# Altium project Capstone.PrjPcb
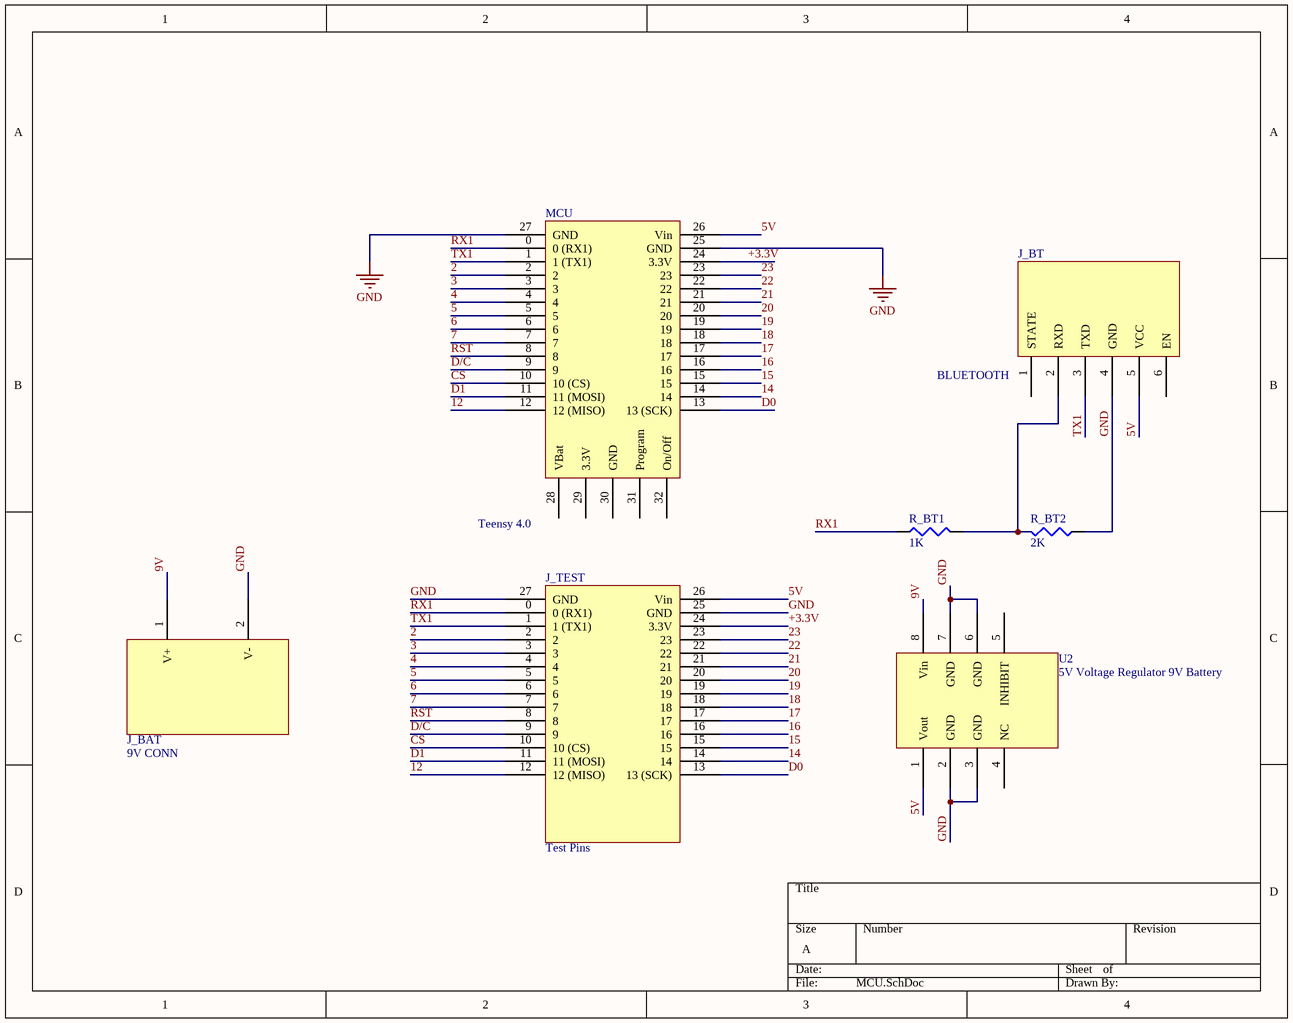
[diagram p0: MCU.SchDoc]
2 sheets, 41 parts. Net scope: global (net labels, ports and power ports of the same name join across sheets).
Board file: PCB.PcbDoc
Sheets:
  MCU.SchDoc
  OLED_BREAKOUT.SchDoc

## Sheet MCU.SchDoc
size A; SheetNumber: 1; SheetTotal: 2

### Parts
J_BAT  9V CONN  [2POS_TERMINAL]
J_BT  BLUETOOTH  [HC05]
J_TEST  Test Pins  [TESTPINS]
MCU  Teensy 4.0  [TEENSY 4.0]
R_BT1  1K  [SMD-0805]
R_BT2  2K  [SMD-0805]
U2  5V Voltage Regulator 9V Battery  [U2_SO-8]

### Nets
+3.3V: J_TEST.24(3.3V) MCU.24(3.3V)
GND: J_BAT.2(V-) J_BT.4(GND) J_TEST.25(GND) J_TEST.27(GND) MCU.25(GND) MCU.27(GND) R_BT2.1 U2.2(GND) U2.3(GND) U2.6(GND) U2.7(GND)
2: J_TEST.2 MCU.2
3: J_TEST.3 MCU.3
4: J_TEST.4 MCU.4
5: J_TEST.5 MCU.5
5V: J_BT.5(VCC) J_TEST.26(Vin) MCU.26(Vin) U2.1(Vout)
6: J_TEST.6 MCU.6
7: J_TEST.7 MCU.7
9V: J_BAT.1(V+) U2.8(Vin)
12: J_TEST.12(12_(MISO)) MCU.12(12_(MISO))
14: J_TEST.14 MCU.14
15: J_TEST.15 MCU.15
16: J_TEST.16 MCU.16
17: J_TEST.17 MCU.17
18: J_TEST.18 MCU.18
19: J_TEST.19 MCU.19
20: J_TEST.20 MCU.20
21: J_TEST.21 MCU.21
22: J_TEST.22 MCU.22
23: J_TEST.23 MCU.23
~{CS}: J_TEST.10(10_(CS)) MCU.10(10_(CS))
D0: J_TEST.13(13_(SCK)) MCU.13(13_(SCK))
D1: J_TEST.11(11_(MOSI)) MCU.11(11_(MOSI))
D/~{C}: J_TEST.9 MCU.9
~{RST}: J_TEST.8 MCU.8
RX1: J_TEST.0(0_(RX1)) MCU.0(0_(RX1)) R_BT1.1
TX1: J_BT.3(TXD) J_TEST.1(1_(TX1)) MCU.1(1_(TX1))
NetJ_BT_2: J_BT.2(RXD) R_BT1.2 R_BT2.2

Not connected (* = marked no-connect by the designer): J_BT 1(STATE) 6(EN); MCU 28(VBat) 29(3.3V) 30(GND) 31(Program) 32(On/Off); U2 4(NC) 5(INHIBIT)

### Library data of the parts
J_BAT = Battery Connector
J_BT = HC05
R_BT1 R_BT2 = Resistor

## Sheet OLED_BREAKOUT.SchDoc
size A; SheetNumber: 2; SheetTotal: 2
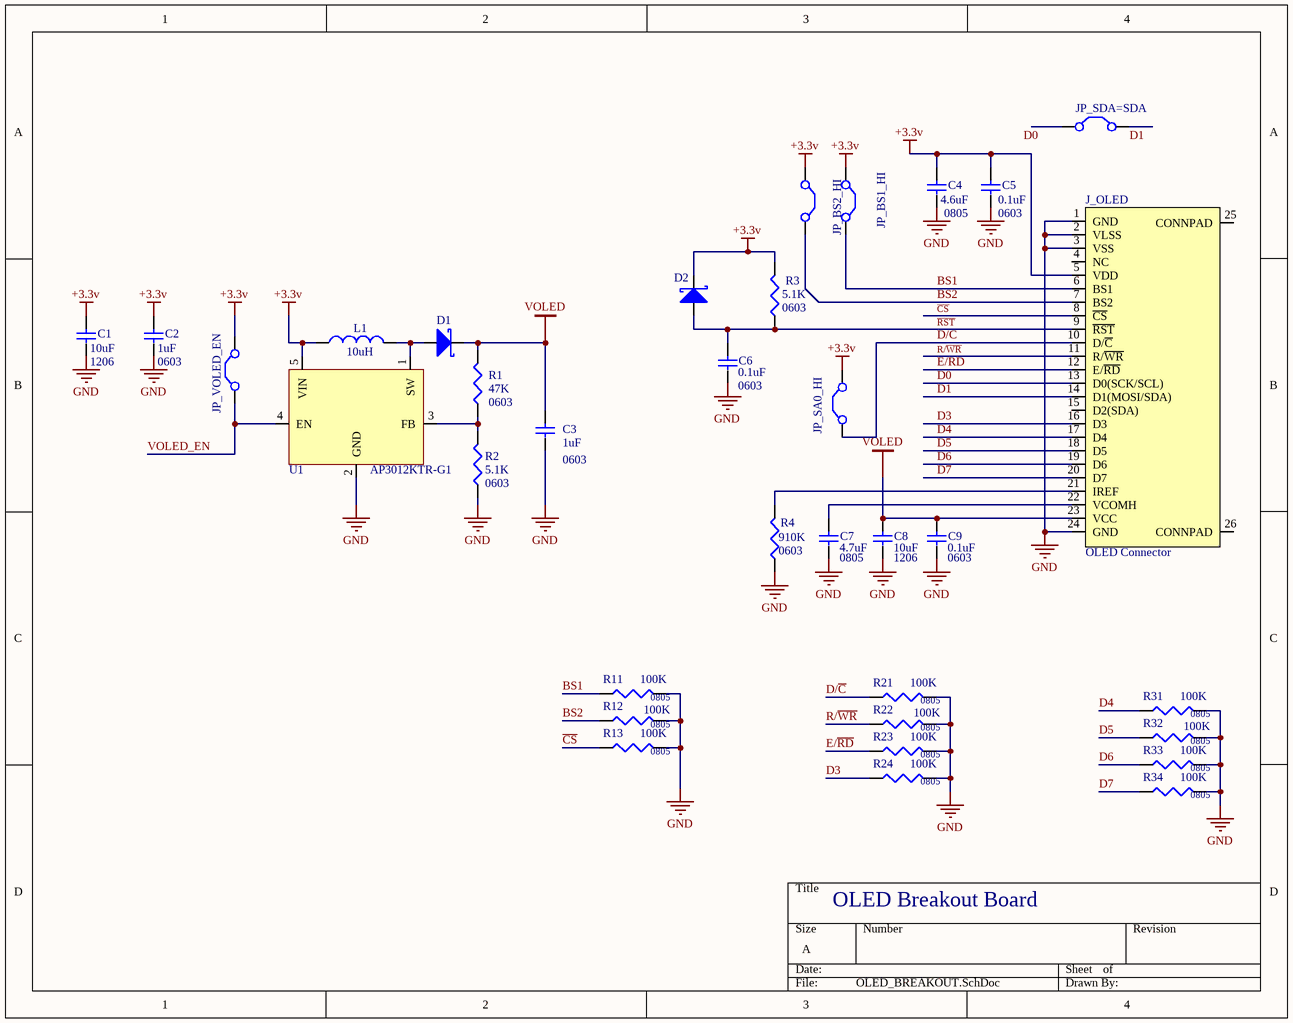
[diagram p1: OLED_BREAKOUT.SchDoc]

### Parts
C1  Capactiance: 10uF  Size: 1206  [SMD-1206]  (hidden comment: Capacitor)
C2  Capacitance: 1uF  Size: 0603  [SMD-0603]  (hidden comment: Capacitor)
C3  Capacitance: 1uF  Size: 0603  [SMD-0603]  (hidden comment: Capacitor)
C4  Capacitance: 4.6uF  Size: 0805  [SMD-0805]  (hidden comment: Capacitor)
C5  Capacitance: 0.1uF  Size: 0603  [SMD-0603]  (hidden comment: Capacitor)
C6  Capacitance: 0.1uF  Size: 0603  [SMD-0603]  (hidden comment: Capacitor)
C7  Capacitance: 4.7uF  Size: 0805  [SMD-0805]  (hidden comment: Capacitor)
C8  Capacitance: 10uF  Size: 1206  [SMD-1206]  (hidden comment: Capacitor)
C9  Capacitance: 0.1uF  Size: 0603  [SMD-0603]  (hidden comment: Capacitor)
D1  Diode Schottky  [D1_SOD-123]  (value not drawn)
D2  Diode Schottky  [D2_SOD523]  (value not drawn)
J_OLED  OLED Connector  [J_OLED]
JP_BS1_HI  Jumper  [SMD-0805]  (value not drawn)
JP_BS2_HI  Jumper  [SMD-0805]  (value not drawn)
JP_SA0_HI  Jumper  [SMD-0805]  (value not drawn)
JP_SDA=SDA  Jumper  [SMD-0805]  (value not drawn)
JP_VOLED_EN  Jumper  [SMD-0805]  (value not drawn)
L1  Inductance: 10uH  [L1]  (hidden comment: Inductor)
R1  Resistance: 47K  Size: 0603  [SMD-0603]  (hidden comment: Resistor)
R2  Resistance: 5.1K  Size: 0603  [SMD-0603]  (hidden comment: Resistor)
R3  Resistance: 5.1K  Size: 0603  [SMD-0603]  (hidden comment: Resistor)
R4  Resistance: 910K  Size: 0603  [SMD-0603]  (hidden comment: Resistor)
R11  Resistance: 100K  SIze: 0805  [SMD-0805]  (hidden comment: Resistor)
R12  Resistance: 100K  SIze: 0805  [SMD-0805]  (hidden comment: Resistor)
R13  Resistance: 100K  SIze: 0805  [SMD-0805]  (hidden comment: Resistor)
R21  Resistance: 100K  SIze: 0805  [SMD-0805]  (hidden comment: Resistor)
R22  Resistance: 100K  SIze: 0805  [SMD-0805]  (hidden comment: Resistor)
R23  Resistance: 100K  SIze: 0805  [SMD-0805]  (hidden comment: Resistor)
R24  Resistance: 100K  SIze: 0805  [SMD-0805]  (hidden comment: Resistor)
R31  Resistance: 100K  SIze: 0805  [SMD-0805]  (hidden comment: Resistor)
R32  Resistance: 100K  SIze: 0805  [SMD-0805]  (hidden comment: Resistor)
R33  Resistance: 100K  SIze: 0805  [SMD-0805]  (hidden comment: Resistor)
R34  Resistance: 100K  SIze: 0805  [SMD-0805]  (hidden comment: Resistor)
U1  Part#: AP3012KTR-G1  [U1_SOT-23-5]  (hidden comment: DC/DC Voltage Regulator)

### Nets
+3.3V: C1.2 C2.2 C4.2 C5.2 D2.2 J_OLED.5(VDD) JP_BS1_HI.1(C1) JP_BS2_HI.1(C1) JP_SA0_HI.2(C2) JP_VOLED_EN.2(C2) L1.1 R3.2 U1.5(VIN)
GND: C1.1 C2.1 C3.1 C4.1 C5.1 C6.1 C7.1 C8.1 C9.1 J_OLED.1(GND) J_OLED.2(VLSS) J_OLED.3(VSS) J_OLED.24(GND) R2.1 R4.1 R11.2 R12.2 R13.2 R21.2 R22.2 R23.2 R24.2 R31.2 R32.2 R33.2 R34.2 U1.2(GND)
VOLED: C3.2 C8.2 C9.2 D1.2 J_OLED.23(VCC) R1.2
BS1: J_OLED.6(BS1) JP_BS1_HI.2(C2) R11.1
BS2: J_OLED.7(BS2) JP_BS2_HI.2(C2) R12.1
~{CS}: J_OLED.8(~{CS}) R13.1
D0: J_OLED.13(D0(SCK/SCL)) JP_SDA=SDA.1(C1)
D1: J_OLED.14(D1(MOSI/SDA)) JP_SDA=SDA.2(C2)
D3: J_OLED.16(D3) R24.1
D4: J_OLED.17(D4) R31.1
D5: J_OLED.18(D5) R32.1
D6: J_OLED.19(D6) R33.1
D7: J_OLED.20(D7) R34.1
D/~{C}: J_OLED.10(D/~{C}) JP_SA0_HI.1(C1) R21.1
E/~{RD}: J_OLED.12(E/~{RD}) R23.1
R/~{WR}: J_OLED.11(R/~{WR}) R22.1
~{RST}: C6.2 D2.1 J_OLED.9(~{RST}) R3.1
VOLED_EN: JP_VOLED_EN.1(C1) U1.4(EN)
NetC7_2: C7.2 J_OLED.22(VCOMH)
NetD1_1: D1.1 L1.2 U1.1(SW)
NetJ_OLED_21: J_OLED.21(IREF) R4.2
NetR1_1: R1.1 R2.2 U1.3(FB)

Not connected (* = marked no-connect by the designer): J_OLED 4(NC) 15(D2(SDA)) 25(CONNPAD) 26(CONNPAD)

### Notes on the sheet
- OLED Breakout Board

### Library data of the parts
J_OLED = OLED Connector: 24 Position, 0.5mm Pitch, Gold, FCC FPC ZIF Connector
JP_BS1_HI JP_BS2_HI JP_SA0_HI JP_SDA=SDA JP_VOLED_EN = Jumper: Jumper Wire; Published: 24-Mar-1999; LatestRevisionDate: 17-Jul-2002; LatestRevisionNote: Re-released for DXP Platform.; PackageReference: RAD-0.2; Publisher: Altium Limited; PackageDescription: Radial Cap, Thru-Hole; 2 Leads; 0.2 in Pin Spacing
U1 = DC/DC Voltage Regulator: Integrated Circuits (ICs) / PMIC - Voltage Regulators - DC DC Switching Regulators

## Nets that join several sheets
+3.3V: MCU (J_TEST.24 MCU.24), OLED_BREAKOUT (13 pins)
GND: MCU (11 pins), OLED_BREAKOUT (27 pins)
~{CS}: MCU (J_TEST.10 MCU.10), OLED_BREAKOUT (J_OLED.8 R13.1)
D0: MCU (J_TEST.13 MCU.13), OLED_BREAKOUT (J_OLED.13 JP_SDA=SDA.1)
D1: MCU (J_TEST.11 MCU.11), OLED_BREAKOUT (J_OLED.14 JP_SDA=SDA.2)
D/~{C}: MCU (J_TEST.9 MCU.9), OLED_BREAKOUT (J_OLED.10 JP_SA0_HI.1 R21.1)
~{RST}: MCU (J_TEST.8 MCU.8), OLED_BREAKOUT (C6.2 D2.1 J_OLED.9 R3.1)